# Altium project Cable_Test.PrjPcb
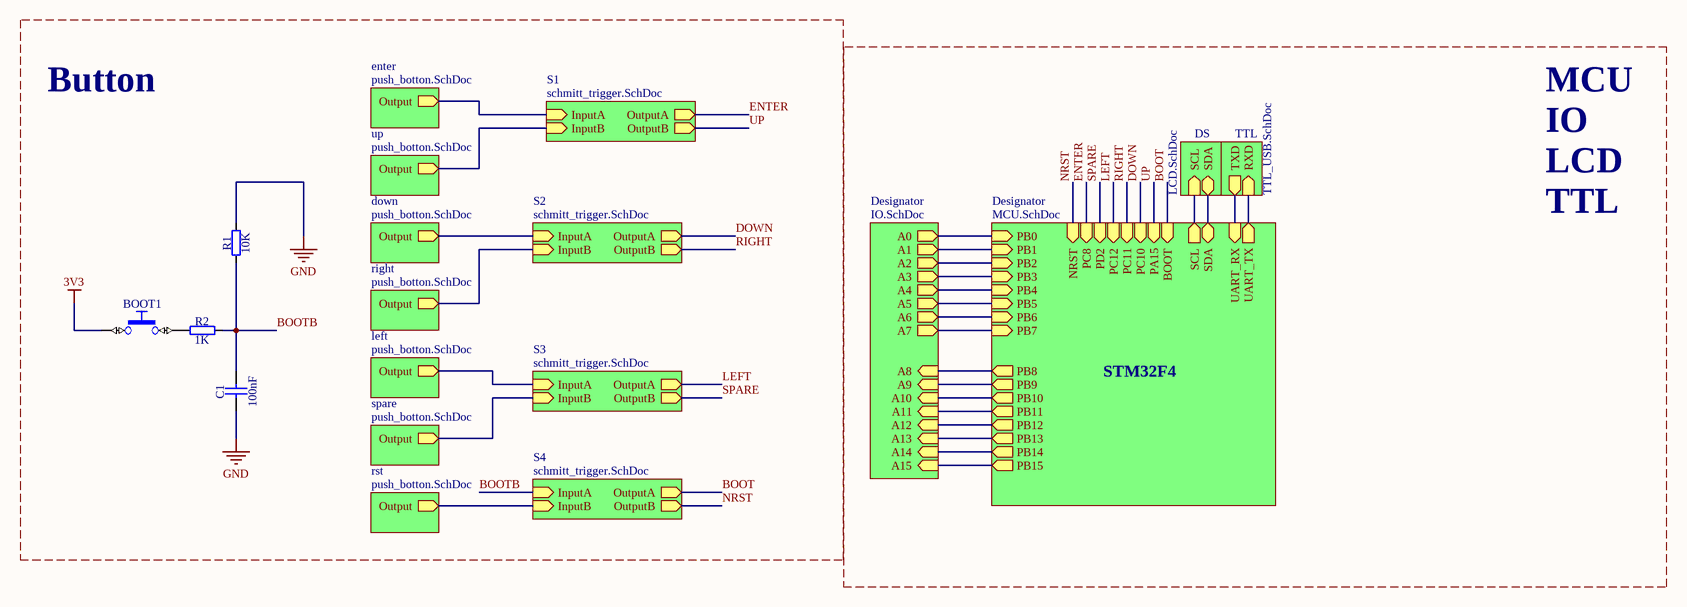
[diagram p0: CABLE_TEST.SchDoc]
8 sheets, 118 parts. Net scope: hierarchical (ports join the sheet entries above them; power ports are global).
Board file: cable_test.PcbDoc
Sheets:
  CABLE_TEST.SchDoc
    down = push_botton.SchDoc
    S1 = schmitt_trigger.SchDoc
    up = push_botton.SchDoc
    left = push_botton.SchDoc
    right = push_botton.SchDoc
    enter = push_botton.SchDoc
    spare = push_botton.SchDoc
    rst = push_botton.SchDoc
    S2 = schmitt_trigger.SchDoc
    S3 = schmitt_trigger.SchDoc
    S4 = schmitt_trigger.SchDoc
    DS = LCD.SchDoc
    TTL = TTL_USB.SchDoc
    Designator = MCU.SchDoc
    Designator = IO.SchDoc
  Power.SchDoc

## Sheet CABLE_TEST.SchDoc
size A3; SheetNumber: 1; SheetTotal: 8

### Parts
BOOT1  Push Button  [PB_TYCO_FSMSM]  (value not drawn)
C1  100nF  [CAPC2012X135N]
R1  10K  [RESC2012X60N]
R2  1K  [RESC2012X60N]

### Blocks framed on the sheet
Button: BOOT1 C1 R1 R2

### Sub-sheets
Designator = MCU.SchDoc: PB0 (in), PB1 (in), PB2 (in), PB3 (in), PB4 (in), PB5 (in), PB6 (in), PB7 (in), PB8 (out), PB10 (out), PB11 (out), PB12 (out), PB13 (out), PB14 (out), PB15 (out), PB9 (out), SCL (out), SDA (bidir), UART_RX (in), UART_TX (out), PD2 (in), PC12 (in), PC11 (in), PC10 (in), PA15 (in), PC8 (in), NRST (in), BOOT (in)
Designator = IO.SchDoc: A0 (out), A1 (out), A2 (out), A3 (out), A4 (out), A5 (out), A6 (out), A7 (out), A8 (in), A9 (in), A10 (in), A11 (in), A12 (in), A13 (in), A14 (in), A15 (in)
down = push_botton.SchDoc: Output (out)
DS = LCD.SchDoc: SCL (in), SDA (bidir)
enter = push_botton.SchDoc: Output (out)
left = push_botton.SchDoc: Output (out)
right = push_botton.SchDoc: Output (out)
rst = push_botton.SchDoc: Output (out)
S1 = schmitt_trigger.SchDoc: InputA (in), InputB (in), OutputA (out), OutputB (out)
S2 = schmitt_trigger.SchDoc: InputA (in), InputB (in), OutputA (out), OutputB (out)
S3 = schmitt_trigger.SchDoc: InputA (in), InputB (in), OutputA (out), OutputB (out)
S4 = schmitt_trigger.SchDoc: InputA (in), InputB (in), OutputA (out), OutputB (out)
spare = push_botton.SchDoc: Output (out)
TTL = TTL_USB.SchDoc: RXD (in), TXD (out)
up = push_botton.SchDoc: Output (out)

### Nets
3V3: BOOT1.1
GND: C1.1 R1.2
A0: sheet Designator/PB0, sheet Designator/A0
A1: sheet Designator/PB1, sheet Designator/A1
A2: sheet Designator/PB2, sheet Designator/A2
A3: sheet Designator/PB3, sheet Designator/A3
A4: sheet Designator/PB4, sheet Designator/A4
A5: sheet Designator/PB5, sheet Designator/A5
A6: sheet Designator/PB6, sheet Designator/A6
A7: sheet Designator/PB7, sheet Designator/A7
A8: sheet Designator/PB8, sheet Designator/A8
A9: sheet Designator/PB9, sheet Designator/A9
A10: sheet Designator/PB10, sheet Designator/A10
A11: sheet Designator/PB11, sheet Designator/A11
A12: sheet Designator/PB12, sheet Designator/A12
A13: sheet Designator/PB13, sheet Designator/A13
A14: sheet Designator/PB14, sheet Designator/A14
A15: sheet Designator/PB15, sheet Designator/A15
BOOT: sheet S4/OutputA, sheet Designator/BOOT
BOOTB: C1.2 R1.1 R2.2 ; sheet S4/InputA
DOWN: sheet S2/OutputA, sheet Designator/PC10
ENTER: sheet S1/OutputA, sheet Designator/PC8
LEFT: sheet S3/OutputA, sheet Designator/PC12
NRST: sheet S4/OutputB, sheet Designator/NRST
PA8: sheet DS/SCL, sheet Designator/SCL
PA9: sheet TTL/RXD, sheet Designator/UART_TX
PA10: sheet TTL/TXD, sheet Designator/UART_RX
PC9: sheet DS/SDA, sheet Designator/SDA
RIGHT: sheet S2/OutputB, sheet Designator/PC11
SPARE: sheet S3/OutputB, sheet Designator/PD2
UP: sheet S1/OutputB, sheet Designator/PA15
NetBOOT1_2: BOOT1.2 R2.1
NetC2_down_2: sheet down/Output, sheet S2/InputA
NetC2_enter_2: sheet S1/InputA, sheet enter/Output
NetC2_left_2: sheet left/Output, sheet S3/InputA
NetC2_right_2: sheet right/Output, sheet S2/InputB
NetC2_rst_2: sheet rst/Output, sheet S4/InputB
NetC2_spare_2: sheet spare/Output, sheet S3/InputB
NetC2_up_2: sheet S1/InputB, sheet up/Output

### Notes on the sheet
- MCU
- IO
- LCD
- TTL
- STM32F4

### Library data of the parts
BOOT1 = PB_TYCO_FSMSM: Push-Button Switch SPST; Part Description: 12VDC 50mA SPST Tactile Push-Button Switch; Manufacturer: TYCO ELECTRONICS; Manufacturer Part Number: FSMSM or 1437566-3; PressFit: No; Part Number: PB_TYCO_FSMSM; Component Kind: Standard; Component Type: Standard; Pin Count: 2; PackageDescription: Body 3.5x6.0mm, Pushbutton Switch, TYCO ALCOSWITCH FSMSM Serie; Family: Push Button; Mounted: Yes; Socket: No; SMD: Yes; Sense: No; Status: None; ComponentHeight: 4.3mm; HelpURL: \\cern.ch\dfs\Applications\Altium\Datasheets\PB_TYCO_FSMSM.pdf; Author: CERN DEM JLC; CreateDate: 6/30/2008; LatestRevisionDate: 6/21/2012
C1 = CC0805_100NF_50V_10%_X7R: Non-polarised capacitor; Part Description: SMD Multilayer Chip Ceramic Capacitor; Manufacturer: GENERIC; Manufacturer1 Part Number: C2012X7R1H104K085; Voltage: 50V; TC: X7R; Tolerance: ±10%; Part Number: CC0805_100NF_50V_10%_X7R; Component Kind: Standard; Component Type: Standard; Pin Count: 2; Value: 100nF; Status: None; Manufacturer Part Number: CC0805_100NF_50V_10%_X7R; Case: 0805; Mounted: Yes; Socket: No; SMD: Yes; Sense: No; Manufacturer1 Example: TDK; Manufacturer1 ComponentHeight: 1mm; HelpURL: \\cern.ch\dfs\Applications\Altium\Datasheets\CC0805_X7R_TDK_C.pdf; Author: CERN DEM JLC; CreateDate: 12/3/2007; LatestRevisionDate: 4/22/2015
R1 R2 = R0805_24K_1%_0.125W_100PPM: Resistor - 1%; Part Description: General Purpose Thick Film Chip Resistor; Manufacturer: GENERIC; Manufacturer1 Part Number: NRC10F2402TRF; Power: 0.125W; TC: ±100ppm/°C; PressFit: No; Part Number: R0805_24K_1%_0.125W_100PPM; Component Kind: Standard; Component Type: Standard; Pin Count: 2; Status: Preferred; Tolerance: ±1%; Manufacturer Part Number: R0805_24K_1%_0.125W_100PPM; Case: 0805; Mounted: Yes; Sense: No; Socket: No; SMD: Yes; HelpURL: \\cern.ch\dfs\Applications\Altium\Datasheets\R0805_NIC_NRC.pdf; Author: CERN DEM JLC; CreateDate: 12/3/2007; LatestRevisionDate: 3/13/2008; Manufacturer1 Example: NIC COMPONENT; Manufacturer1 ComponentHeight: 0.6mm
  R1: Value: 10K
  R2: Value: 1K

## Sheet push_botton.SchDoc
size A; SheetNumber: 2; SheetTotal: 8
Used 7 times, as channels down, up, left, right, enter, spare, rst. Parts and nets are listed once, with the designators drawn on the sheet.
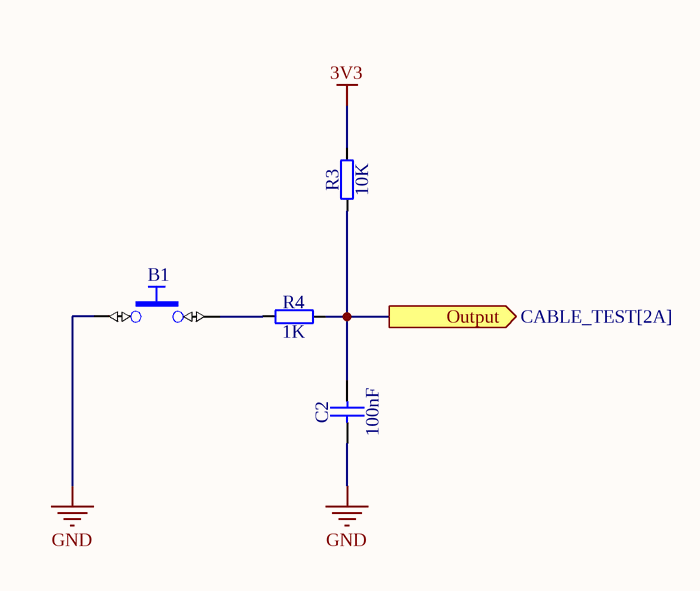
[diagram p1: push_botton.SchDoc]

### Parts
B1  Push Button  [PB_TYCO_FSMSM]  (value not drawn)
C2  100nF  [CAPC2012X135N]
R3  10K  [RESC2012X60N]
R4  1K  [RESC2012X60N]

### Ports
Output (out, see CABLE_TEST[2A])

### Nets
3V3: R3.2
GND: B1.1 C2.1
Output: C2.2 R3.1 R4.2 ; port Output
NetB1_2: B1.2 R4.1

### Channels
down: designators end in _down; ports Output=NetC2_down_2
up: designators end in _up; ports Output=NetC2_up_2
left: designators end in _left; ports Output=NetC2_left_2
right: designators end in _right; ports Output=NetC2_right_2
enter: designators end in _enter; ports Output=NetC2_enter_2
spare: designators end in _spare; ports Output=NetC2_spare_2
rst: designators end in _rst; ports Output=NetC2_rst_2

### Library data of the parts
B1 = PB_TYCO_FSMSM: as BOOT1 on sheet CABLE_TEST; Part Number: PB_TYCO_FSMSM; Component Kind: Standard; Component Type: Standard; Pin Count: 2; PackageDescription: Body 3.5x6.0mm, Pushbutton Switch, TYCO ALCOSWITCH FSMSM Serie; Family: Push Button; Mounted: Yes; Socket: No; SMD: Yes; Sense: No; Status: None; ComponentHeight: 4.3mm; HelpURL: \\cern.ch\dfs\Applications\Altium\Datasheets\PB_TYCO_FSMSM.pdf; Author: CERN DEM JLC; CreateDate: 6/30/2008; LatestRevisionDate: 6/21/2012
C2 = CC0805_100NF_50V_10%_X7R: as C1 on sheet CABLE_TEST; Part Number: CC0805_100NF_50V_10%_X7R; Component Kind: Standard; Component Type: Standard; Pin Count: 2; Value: 100nF; Status: None; Manufacturer Part Number: CC0805_100NF_50V_10%_X7R; Case: 0805; Mounted: Yes; Socket: No; SMD: Yes; Sense: No; Manufacturer1 Example: TDK; Manufacturer1 ComponentHeight: 1mm; HelpURL: \\cern.ch\dfs\Applications\Altium\Datasheets\CC0805_X7R_TDK_C.pdf; Author: CERN DEM JLC; CreateDate: 12/3/2007; LatestRevisionDate: 4/22/2015
R3 R4 = R0805_24K_1%_0.125W_100PPM: as R1 on sheet CABLE_TEST; Part Number: R0805_24K_1%_0.125W_100PPM; Component Kind: Standard; Component Type: Standard; Pin Count: 2; Status: Preferred; Tolerance: ±1%; Manufacturer Part Number: R0805_24K_1%_0.125W_100PPM; Case: 0805; Mounted: Yes; Sense: No; Socket: No; SMD: Yes; HelpURL: \\cern.ch\dfs\Applications\Altium\Datasheets\R0805_NIC_NRC.pdf; Author: CERN DEM JLC; CreateDate: 12/3/2007; LatestRevisionDate: 3/13/2008; Manufacturer1 Example: NIC COMPONENT; Manufacturer1 ComponentHeight: 0.6mm
  R3: Value: 10K
  R4: Value: 1K

## Sheet schmitt_trigger.SchDoc
size A; SheetNumber: 3; SheetTotal: 8
Used 4 times, as channels S1, S2, S3, S4. Parts and nets are listed once, with the designators drawn on the sheet.
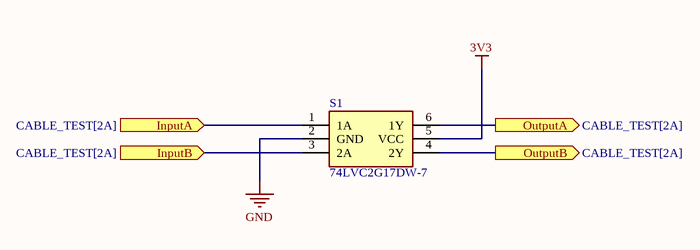
[diagram p2: schmitt_trigger.SchDoc]

### Parts
S1  74LVC2G17DW-7  [SOT65P210X110-6N]

### Ports
InputA (in, see CABLE_TEST[2A]), InputB (in, see CABLE_TEST[2A]), OutputA (out, see CABLE_TEST[2A]), OutputB (out, see CABLE_TEST[2A])

### Nets
3V3: S1.5(VCC)
GND: S1.2(GND)
InputA: S1.1(1A) ; port InputA
InputB: S1.3(2A) ; port InputB
OutputA: S1.6(1Y) ; port OutputA
OutputB: S1.4(2Y) ; port OutputB

### Channels
S1: designators end in _S1; ports InputA=NetC2_enter_2 InputB=NetC2_up_2 OutputA=ENTER OutputB=UP
S2: designators end in _S2; ports InputA=NetC2_down_2 InputB=NetC2_right_2 OutputA=DOWN OutputB=RIGHT
S3: designators end in _S3; ports InputA=NetC2_left_2 InputB=NetC2_spare_2 OutputA=LEFT OutputB=SPARE
S4: designators end in _S4; ports InputA=BOOTB InputB=NetC2_rst_2 OutputA=BOOT OutputB=NRST

### Library data of the parts
S1 = 74LVC2G17DW-7: Integrated Circuit; Manufacturer_Name: Diodes Incorporated; Datasheet Link: https://www.diodes.com//assets/Datasheets/74LVC2G17.pdf; Height: 1.1mm; Manufacturer_Part_Number: 74LVC2G17DW-7; Mouser Part Number: 621-74LVC2G17DW-7; Mouser Price/Stock: https://www.mouser.co.uk/ProductDetail/Diodes-Incorporated/74LVC2G17DW-7?qs=MKoP7Oyr0W5RvcSrLnJhQA%3D%3D; Arrow Part Number: 74LVC2G17DW-7; Arrow Price/Stock: https://www.arrow.com/en/products/74lvc2g17dw-7/diodes-incorporated?utm_currency=USD&region=nac

## Sheet LCD.SchDoc
size A; SheetNumber: 4; SheetTotal: 8
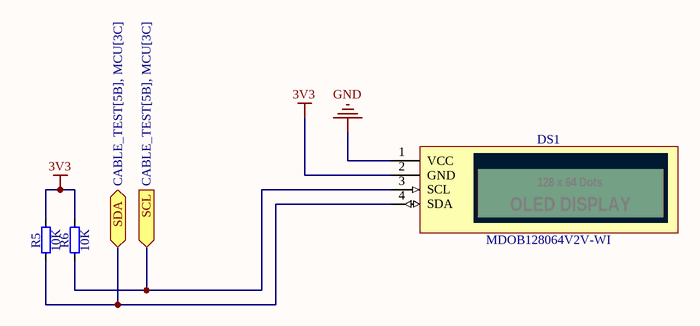
[diagram p3: LCD.SchDoc]

### Parts
DS1  MDOB128064V2V-WI  [DS_MIDAS_MDOB128064V2V-WI]
R5  10K  [RESC2012X60N]
R6  10K  [RESC2012X60N]

### Ports
SCL (in, see CABLE_TEST[5B], MCU[3C]), SDA (bidir, see CABLE_TEST[5B], MCU[3C])

### Nets
3V3: DS1.2(GND) R5.2 R6.2
GND: DS1.1(VCC)
PA8: DS1.3(SCL) R6.1 ; port SCL
PC9: DS1.4(SDA) R5.1 ; port SDA

### Notes on the sheet
- (in symbol DS_MIDAS_MDOB128064V2V-WI) 128 x 64 Dots; OLED DISPLAY

### Library data of the parts
DS1 = DS_MIDAS_MDOB128064V2V-WI: LCD Display, Display Color White, I2C Bus Data Interface, 128 x 64 Dots Matrix; Manufacturer: MIDAS DISPLAY; PressFit: No; Sense Comment: Manual Soldering and Non-washable; Bonding: No; Status Comment: Sensitive (See Sensitive Field); Part Number: DS_MIDAS_MDOB128064V2V-WI; Component Kind: Standard; Component Type: Standard; Device: MDOB128064V2V-WI; PackageDescription: LCD Display Module, 128 x 64 Dots Matrix, Body 27.3x27.3mm; Part Description: LCD Display, Display Color White, I2C Bus Data Interface, 128 x 64 Dots Matrix; Manufacturer Part Number: MDOB128064V2V-WI; Pin Count: 4; Mounted: Yes; Socket: No; SMD: No; Sense: Yes; ComponentHeight: 3.87mm; HelpURL: \\cern.ch\dfs\Applications\Altium\Datasheets\DS_MIDAS_MDOB128064V2V-WI.pdf; Author: CERN DEM BC; CreateDate: 1/27/2020; LatestRevisionDate: 1/27/2020
R5 R6 = R0805_24K_1%_0.125W_100PPM: as R1 on sheet CABLE_TEST; Part Number: R0805_24K_1%_0.125W_100PPM; Component Kind: Standard; Component Type: Standard; Pin Count: 2; Value: 10K; Status: Preferred; Tolerance: ±1%; Manufacturer Part Number: R0805_24K_1%_0.125W_100PPM; Case: 0805; Mounted: Yes; Sense: No; Socket: No; SMD: Yes; HelpURL: \\cern.ch\dfs\Applications\Altium\Datasheets\R0805_NIC_NRC.pdf; Author: CERN DEM JLC; CreateDate: 12/3/2007; LatestRevisionDate: 3/13/2008; Manufacturer1 Example: NIC COMPONENT; Manufacturer1 ComponentHeight: 0.6mm

## Sheet TTL_USB.SchDoc
size A; SheetNumber: 5; SheetTotal: 8
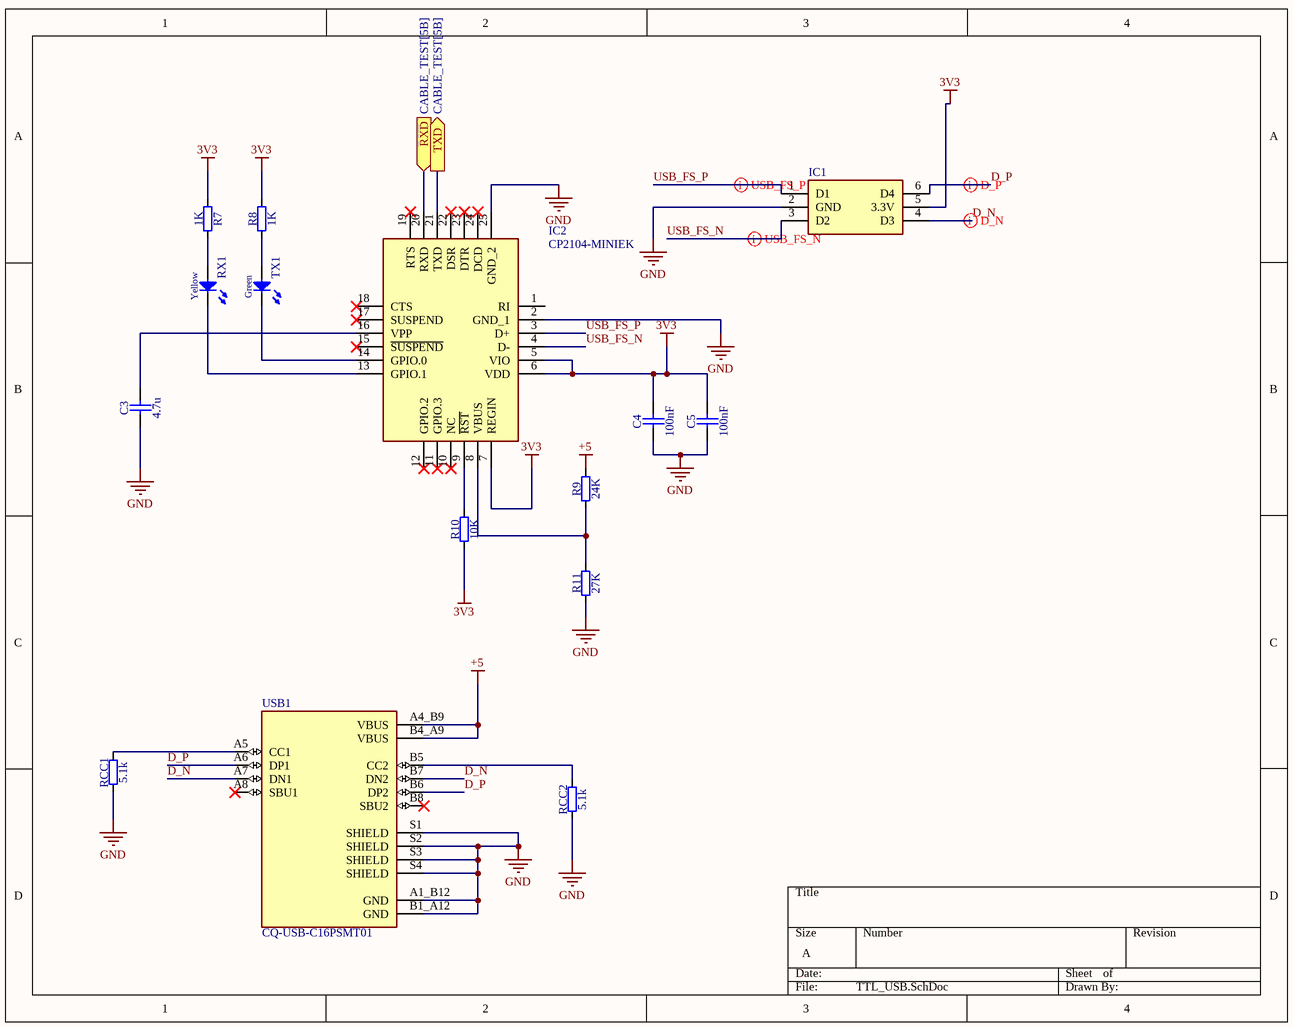
[diagram p4: TTL_USB.SchDoc]

### Parts
C3  4.7u  [CAPC2012X135N]
C4  100nF  [CAPC2012X135N]
C5  100nF  [CAPC2012X135N]
IC1  (no value)  [SOT65P210X110-6N]
IC2  CP2104-MINIEK  [QFN50P400X400X80-25N-D]
R7  1K  [RESC2012X60N]
R8  1K  [RESC2012X60N]
R9  24K  [RESC2012X60N]
R10  10K  [RESC2012X60N]
R11  27K  [RESC2012X60N]
RCC1  5.1k  [RESC2012X60N]
RCC2  5.1k  [RESC2012X60N]
RX1  Yellow  [LED_3MM_YELLOW_1C-2A]
TX1  Green  [LED_3MM_GREEN_1C-2A]
USB1  CQ-USB-C16PSMT01  [SHENZHEN-CHUANGQIN-TECHNOLOGY_CQ-USB-C16PSMT01]

### Ports
RXD (in, see CABLE_TEST[5B]), TXD (out, see CABLE_TEST[5B])

### Nets
3V3: C4.2 C5.2 IC1.5(3.3V) IC2.5(VIO) IC2.6(VDD) IC2.7(REGIN) R7.1 R8.2 R10.1
+5: R9.2 USB1.A4_B9(VBUS) USB1.B4_A9(VBUS)
GND: C3.1 C4.1 C5.1 IC1.2(GND) IC2.2(GND_1) IC2.25(GND_2) R11.1 RCC1.1 RCC2.1 USB1.A1_B12(GND) USB1.B1_A12(GND) USB1.S1(SHIELD) USB1.S2(SHIELD) USB1.S3(SHIELD) USB1.S4(SHIELD)
D_N: IC1.4(D3) USB1.A7(DN1) USB1.B7(DN2)
D_P: IC1.6(D4) USB1.A6(DP1) USB1.B6(DP2)
PA9: IC2.20(RXD) ; port RXD
PA10: IC2.21(TXD) ; port TXD
USB_FS_N: IC1.3(D2) IC2.4(D-)
USB_FS_P: IC1.1(D1) IC2.3(D+)
NetC3_2: C3.2 IC2.16(VPP)
NetIC2_8: IC2.8(VBUS) R9.1 R11.2
NetIC2_9: IC2.9(~{RST}) R10.2
NetIC2_13: IC2.13(GPIO.1) RX1.1(C)
NetIC2_14: IC2.14(GPIO.0) TX1.1(C)
NetR7_2: R7.2 RX1.2(A)
NetR8_1: R8.1 TX1.2(A)
NetRCC1_2: RCC1.2 USB1.A5(CC1)
NetRCC2_2: RCC2.2 USB1.B5(CC2)

Not connected (* = marked no-connect by the designer): IC2 1(RI) 10(NC)* 11(GPIO.3)* 12(GPIO.2)* 15(~{SUSPEND})* 17(SUSPEND)* 18(CTS)* 19(RTS)* 22(DSR)* 23(DTR)* 24(DCD)*; USB1 A8(SBU1)* B8(SBU2)*

### Layout directives
differential pair: D_N, D_P, USB_FS_N, USB_FS_P

### Library data of the parts
C3-C5 = CC0805_100NF_50V_10%_X7R: as C1 on sheet CABLE_TEST; Part Number: CC0805_100NF_50V_10%_X7R; Component Kind: Standard; Component Type: Standard; Pin Count: 2; Status: None; Manufacturer Part Number: CC0805_100NF_50V_10%_X7R; Case: 0805; Mounted: Yes; Socket: No; SMD: Yes; Sense: No; Manufacturer1 Example: TDK; Manufacturer1 ComponentHeight: 1mm; HelpURL: \\cern.ch\dfs\Applications\Altium\Datasheets\CC0805_X7R_TDK_C.pdf; Author: CERN DEM JLC; CreateDate: 12/3/2007; LatestRevisionDate: 4/22/2015
  C3: Value: 4.7u
  C4 C5: Value: 100nF
IC1 = USBUF02W6: Integrated Circuit; IPN: 1245; Voltage: 8KV; Category: Diode; Mounting Type: SMD
IC2 = CP2104-MINIEK: Integrated Circuit; Manufacturer_Name: Silicon Labs; Datasheet Link: https://www.silabs.com/documents/public/data-sheets/cp2104.pdf; Height: 0.8mm; Manufacturer_Part_Number: CP2104-MINIEK; Mouser Part Number: 634-CP2104-MINIEK; Mouser Price/Stock: https://www.mouser.co.uk/ProductDetail/Silicon-Labs/CP2104-MINIEK?qs=FYfXKmhrYXPeBq%2FwIaWTFg%3D%3D; Arrow Part Number: CP2104-MINIEK; Arrow Price/Stock: https://www.arrow.com/en/products/cp2104-miniek/silicon-labs?utm_currency=USD&region=nac
R7-R11 RCC1 RCC2 = R0805_24K_1%_0.125W_100PPM: as R1 on sheet CABLE_TEST; Part Number: R0805_24K_1%_0.125W_100PPM; Component Kind: Standard; Component Type: Standard; Pin Count: 2; Status: Preferred; Tolerance: ±1%; Manufacturer Part Number: R0805_24K_1%_0.125W_100PPM; Case: 0805; Mounted: Yes; Sense: No; Socket: No; SMD: Yes; HelpURL: \\cern.ch\dfs\Applications\Altium\Datasheets\R0805_NIC_NRC.pdf; Author: CERN DEM JLC; CreateDate: 12/3/2007; LatestRevisionDate: 3/13/2008; Manufacturer1 Example: NIC COMPONENT; Manufacturer1 ComponentHeight: 0.6mm
  R7 R8: Value: 1K
  R9: Value: 24K
  R10: Value: 10K
  R11: Value: 27K
  RCC1 RCC2: Value: 5.1k
RX1 = LED_AVAGO_HLMP-1719: LED Yellow 1C 2A; Part Description: 3mm Yellow LED; Manufacturer: AVAGO TECHNOLOGIES; PressFit: No; Bonding: No; Part Number: LED_AVAGO_HLMP-1719; Component Kind: Standard; Component Type: Standard; Color: Yellow; PackageDescription: LED, Yellow, Body Dia. 3.43 mm, Pin spacing 2.54mm; Manufacturer Part Number: HLMP-1719; Pin Count: 2; Mounted: Yes; Socket: No; SMD: No; Sense: No; ComponentHeight: 6.35mm(min); HelpURL: \\cern.ch\dfs\Applications\Altium\Datasheets\LED_AVAGO_HLMP-1719.pdf; Author: CERN DEM JLC; CreateDate: 6/12/2008; LatestRevisionDate: 3/17/2010
TX1 = LED_AVAGO_HLMP-1790: LED Green 1C 2A; Part Description: 3mm Green LED; Manufacturer: AVAGO TECHNOLOGIES; PressFit: No; Bonding: No; Part Number: LED_AVAGO_HLMP-1790; Component Kind: Standard; Component Type: Standard; Color: Green; PackageDescription: LED, Green, Body Dia. 3.43 mm, Pin spacing 2.54mm; Manufacturer Part Number: HLMP-1790; Pin Count: 2; Mounted: Yes; Socket: No; SMD: No; Sense: No; ComponentHeight: 6.35mm(min); HelpURL: \\cern.ch\dfs\Applications\Altium\Datasheets\LED_AVAGO_HLMP-1790.pdf; Author: CERN DEM JLC; CreateDate: 6/12/2008; LatestRevisionDate: 3/17/2010
USB1 = CQ-USB-C16PSMT01: C Type USB Type-C Female Plug 16 Pin Connector Power Charger Jack Port; MF: Shenzen Chuangqin Technology; SnapEDA_Link: https://www.snapeda.com/parts/CQ-USB-C16PSMT01/Shenzen+Chuangqin+Technology/view-part/?ref=snap; Package: Package; Value: *; MP: CQ-USB-C16PSMT01; Check_prices: https://www.snapeda.com/parts/CQ-USB-C16PSMT01/Shenzen+Chuangqin+Technology/view-part/?ref=eda

## Sheet MCU.SchDoc
size A3; SheetNumber: 6; SheetTotal: 8
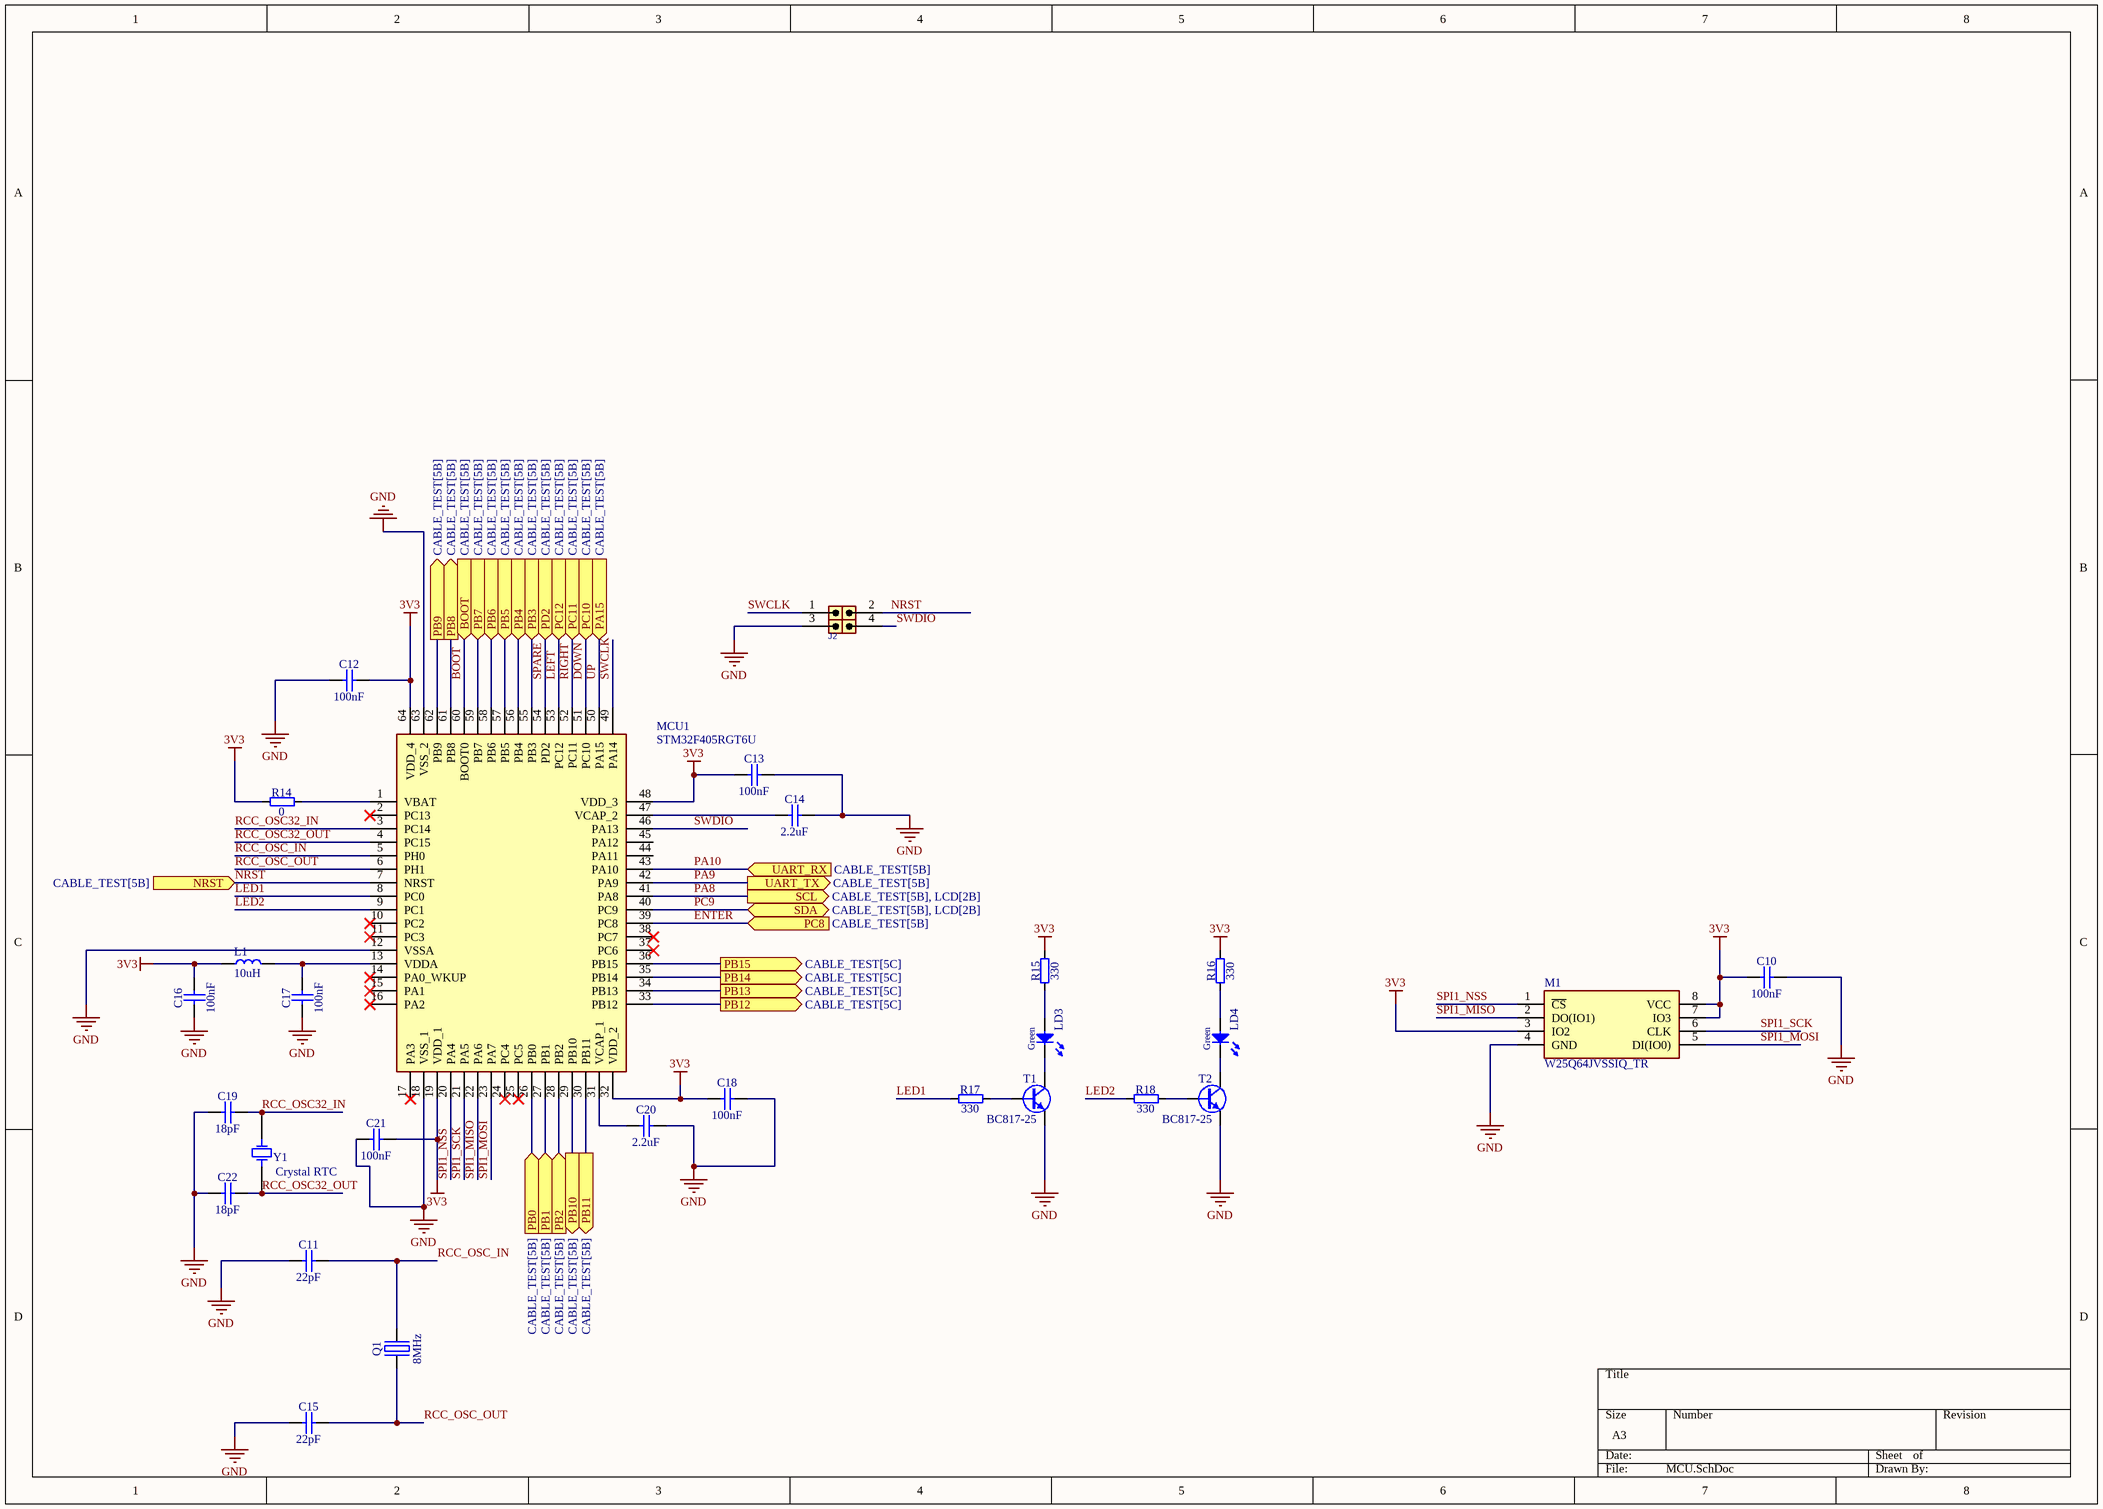
[diagram p5: MCU.SchDoc]

### Parts
C10  100nF  [CAPC2012X135N]
C11  22pF  [CAPC2012X135N]
C12  100nF  [CAPC2012X135N]
C13  100nF  [CAPC2012X135N]
C14  2.2uF  [CAPC2012X135N]
C15  22pF  [CAPC2012X135N]
C16  100nF  [CAPC2012X135N]
C17  100nF  [CAPC2012X135N]
C18  100nF  [CAPC2012X135N]
C19  18pF  [CAPC2012X135N]
C20  2.2uF  [CAPC2012X135N]
C21  100nF  [CAPC2012X135N]
C22  18pF  [CAPC2012X135N]
J2  Female Header dual 2  [HDR_F_2X2]  (value not drawn)
L1  value 10uH  [L0805]  (hidden comment: Inductor SMD NC 0805)
LD3  Green  [LED_3MM_GREEN_1C-2A]
LD4  Green  [LED_3MM_GREEN_1C-2A]
M1  W25Q64JVSSIQ_TR  [SOIC127P790X216-8N]
MCU1  STM32F405RGT6U  [QFP50P1200X1200X160-64N]
Q1  8MHz  [XTAL_CTS_ATS]
R14  0  [RESC2012X60N]
R15  330  [RESC2012X60N]
R16  330  [RESC2012X60N]
R17  330  [RESC2012X60N]
R18  330  [RESC2012X60N]
T1  BC817-25  [SOT95P230X110-3N]
T2  BC817-25  [SOT95P230X110-3N]
Y1  Crystal RTC  [Crystal Clock]

### Ports
BOOT (in, see CABLE_TEST[5B]), NRST (in, see CABLE_TEST[5B]), PA15 (in, see CABLE_TEST[5B]), PB0 (in, see CABLE_TEST[5B]), PB1 (in, see CABLE_TEST[5B]), PB2 (in, see CABLE_TEST[5B]), PB3 (in, see CABLE_TEST[5B]), PB4 (in, see CABLE_TEST[5B]), PB5 (in, see CABLE_TEST[5B]), PB6 (in, see CABLE_TEST[5B]), PB7 (in, see CABLE_TEST[5B]), PB8 (out, see CABLE_TEST[5B]), PB9 (out, see CABLE_TEST[5B]), PB10 (out, see CABLE_TEST[5B]), PB11 (out, see CABLE_TEST[5B]), PB12 (out, see CABLE_TEST[5C]), PB13 (out, see CABLE_TEST[5C]), PB14 (out, see CABLE_TEST[5C]), PB15 (out, see CABLE_TEST[5C]), PC8 (in, see CABLE_TEST[5B]), PC10 (in, see CABLE_TEST[5B]), PC11 (in, see CABLE_TEST[5B]), PC12 (in, see CABLE_TEST[5B]), PD2 (in, see CABLE_TEST[5B]), SCL (out, see CABLE_TEST[5B], LCD[2B]), SDA (bidir, see CABLE_TEST[5B], LCD[2B]), UART_RX (in, see CABLE_TEST[5B]), UART_TX (out, see CABLE_TEST[5B])

### Nets
3V3: C10.1 C12.2 C13.1 C16.2 C18.1 C21.2 L1.1 M1.3(IO2) M1.7(IO3) M1.8(VCC) MCU1.19(VDD_1) MCU1.32(VDD_2) MCU1.48(VDD_3) MCU1.64(VDD_4) R14.1 R15.2 R16.2
GND: C10.2 C11.1 C12.1 C13.2 C14.2 C15.1 C16.1 C17.1 C18.2 C19.1 C20.2 C21.1 C22.1 J2.3 M1.4(GND) MCU1.12(VSSA) MCU1.18(VSS_1) MCU1.63(VSS_2) T1.2(E) T2.2(E)
A0: MCU1.26(PB0) ; port PB0
A1: MCU1.27(PB1) ; port PB1
A2: MCU1.28(PB2) ; port PB2
A3: MCU1.55(PB3) ; port PB3
A4: MCU1.56(PB4) ; port PB4
A5: MCU1.57(PB5) ; port PB5
A6: MCU1.58(PB6) ; port PB6
A7: MCU1.59(PB7) ; port PB7
A8: MCU1.61(PB8) ; port PB8
A9: MCU1.62(PB9) ; port PB9
A10: MCU1.29(PB10) ; port PB10
A11: MCU1.30(PB11) ; port PB11
A12: MCU1.33(PB12) ; port PB12
A13: MCU1.34(PB13) ; port PB13
A14: MCU1.35(PB14) ; port PB14
A15: MCU1.36(PB15) ; port PB15
BOOT: MCU1.60(BOOT0) ; port BOOT
DOWN: MCU1.51(PC10) ; port PC10
ENTER: MCU1.39(PC8) ; port PC8
LED1: MCU1.8(PC0) R17.1
LED2: MCU1.9(PC1) R18.1
LEFT: MCU1.53(PC12) ; port PC12
NRST: J2.2 MCU1.7(NRST) ; port NRST
PA8: MCU1.41(PA8) ; port SCL
PA9: MCU1.42(PA9) ; port UART_TX
PA10: MCU1.43(PA10) ; port UART_RX
PC9: MCU1.40(PC9) ; port SDA
RCC_OSC32_IN: C19.2 MCU1.3(PC14) Y1.1
RCC_OSC32_OUT: C22.2 MCU1.4(PC15) Y1.2
RCC_OSC_IN: C11.2 MCU1.5(PH0) Q1.2(OSC2)
RCC_OSC_OUT: C15.2 MCU1.6(PH1) Q1.1(OSC1)
RIGHT: MCU1.52(PC11) ; port PC11
SPARE: MCU1.54(PD2) ; port PD2
SPI1_MISO: M1.2(DO(IO1)) MCU1.22(PA6)
SPI1_MOSI: M1.5(DI(IO0)) MCU1.23(PA7)
SPI1_NSS: M1.1(~{CS}) MCU1.20(PA4)
SPI1_SCK: M1.6(CLK) MCU1.21(PA5)
SWCLK: J2.1 MCU1.49(PA14)
SWDIO: J2.4 MCU1.46(PA13)
UP: MCU1.50(PA15) ; port PA15
NetC14_1: C14.1 MCU1.47(VCAP_2)
NetC17_2: C17.2 L1.2 MCU1.13(VDDA)
NetC20_1: C20.1 MCU1.31(VCAP_1)
NetLD3_1: LD3.1(C) T1.3(C)
NetLD3_2: LD3.2(A) R15.1
NetLD4_1: LD4.1(C) T2.3(C)
NetLD4_2: LD4.2(A) R16.1
NetMCU1_1: MCU1.1(VBAT) R14.2
NetR17_2: R17.2 T1.1(B)
NetR18_2: R18.2 T2.1(B)

Not connected (* = marked no-connect by the designer): MCU1 2(PC13)* 10(PC2)* 11(PC3)* 14(PA0_WKUP)* 15(PA1)* 16(PA2)* 17(PA3)* 24(PC4)* 25(PC5)* 37(PC6)* 38(PC7)* 44(PA11) 45(PA12)

### Library data of the parts
C10 = CC0805_1.2PF_50V_0.25PF_NP0: Non-polarised capacitor; Part Description: SMD Multilayer Chip Ceramic Capacitor; Manufacturer: GENERIC; Manufacturer1 Part Number: 223886114128; Voltage: 50V; TC: C0G/NP0; Tolerance: ±0.25pF; Part Number: CC0805_1.2PF_50V_0.25PF_NP0; Component Kind: Standard; Component Type: Standard; Pin Count: 2; Value: 100nF; Status: Not Recommended; Manufacturer Part Number: CC0805_1.2PF_50V_0.25PF_NP0; Case: 0805; Mounted: Yes; Socket: No; SMD: Yes; Sense: No; Manufacturer1 Example: PHYCOMP; Manufacturer1 ComponentHeight: 1.35mm; HelpURL: \\cern.ch\dfs\Applications\Altium\Datasheets\CC0805_NP0_PHYCOMP.pdf; Author: CERN DEM JLC; CreateDate: 12/3/2007; LatestRevisionDate: 12/3/2007
C11-C22 = CC0805_100NF_50V_10%_X7R: as C1 on sheet CABLE_TEST; Part Number: CC0805_100NF_50V_10%_X7R; Component Kind: Standard; Component Type: Standard; Pin Count: 2; Status: None; Manufacturer Part Number: CC0805_100NF_50V_10%_X7R; Case: 0805; Mounted: Yes; Socket: No; SMD: Yes; Sense: No; Manufacturer1 Example: TDK; Manufacturer1 ComponentHeight: 1mm; HelpURL: \\cern.ch\dfs\Applications\Altium\Datasheets\CC0805_X7R_TDK_C.pdf; Author: CERN DEM JLC; CreateDate: 12/3/2007; LatestRevisionDate: 4/22/2015
  C11 C15: Value: 22pF
  C12 C13 C16-C18 C21: Value: 100nF
  C14 C20: Value: 2.2uF
  C19 C22: Value: 18pF
J2 = Female Header dual 2: Female, pitch: 2.54mm; Category: Connector
L1 = Inductor SMD NC 0805: Current: 200mA; IPN: 1030; Category: inductor; Package: 0805; Mounting Type: SMD
LD3 LD4 = LED_AVAGO_HLMP-1790: as TX1 on sheet TTL_USB; Part Number: LED_AVAGO_HLMP-1790; Component Kind: Standard; Component Type: Standard; Color: Green; PackageDescription: LED, Green, Body Dia. 3.43 mm, Pin spacing 2.54mm; Manufacturer Part Number: HLMP-1790; Pin Count: 2; Mounted: Yes; Socket: No; SMD: No; Sense: No; ComponentHeight: 6.35mm(min); HelpURL: \\cern.ch\dfs\Applications\Altium\Datasheets\LED_AVAGO_HLMP-1790.pdf; Author: CERN DEM JLC; CreateDate: 6/12/2008; LatestRevisionDate: 3/17/2010
M1 = W25Q64JVSSIQ_TR: Integrated Circuit; Manufacturer_Name: Winbond; Manufacturer_Part_Number: W25Q64JVSSIQ TR; Datasheet Link: http://www.winbond.com/resource-files/w25q64jv%20spi%20revg%2012142016.pdf; Height: 2.16mm; Mouser Part Number: 454-W25Q64JVSSIQTR; Mouser Price/Stock: https://www.mouser.co.uk/ProductDetail/Winbond/W25Q64JVSSIQ-TR?qs=qSfuJ%252Bfl%2Fd6FZTXsjBFnrA%3D%3D; Arrow Part Number: W25Q64JVSSIQ TR; Arrow Price/Stock: https://www.arrow.com/en/products/w25q64jvssiqtr/winbond-electronics?utm_currency=USD&region=nac
MCU1 = STM32F405RGT6U: Integrated Circuit; Manufacturer_Name: STMicroelectronics; Height: 1.6mm; Manufacturer_Part_Number: STM32F405RGT6U; Mouser Part Number: 511-STM32F405RGT6U; Mouser Price/Stock: https://www.mouser.co.uk/ProductDetail/STMicroelectronics/STM32F405RGT6U?qs=4ccVDqXDOrkfyBTYAli8sw%3D%3D
Q1 = XTAL_10MHZ_CTS_ATS100B-E: Quartz Crystal; Part Description: Tolerance: ±30ppm, Stability: ±50ppm, -40°C to +85°C, 18pF, 40 Ohms ESR, Quartz Crystal, ATS Series; Manufacturer: CTS; PressFit: No; Bonding: No; Part Number: XTAL_10MHZ_CTS_ATS100B-E; Component Kind: Standard; Component Type: Standard; PackageDescription: THD Crystal,HC-49/US Case Body 10.85x4.5mm; Pitch 4.88mm; Value: 8MHz; Manufacturer Part Number: ATS100B-E; Pin Count: 2; Mounted: Yes; Socket: No; SMD: No; Sense: No; ComponentHeight: 3.3mm; HelpURL: \\cern.ch\dfs\Applications\Altium\Datasheets\XTAL_CTS_ATS.pdf; Author: CERN DEM HF; CreateDate: 10/25/2022; LatestRevisionDate: 10/25/2022
R14-R18 = R0805_24K_1%_0.125W_100PPM: as R1 on sheet CABLE_TEST; Part Number: R0805_24K_1%_0.125W_100PPM; Component Kind: Standard; Component Type: Standard; Pin Count: 2; Status: Preferred; Tolerance: ±1%; Manufacturer Part Number: R0805_24K_1%_0.125W_100PPM; Case: 0805; Mounted: Yes; Sense: No; Socket: No; SMD: Yes; HelpURL: \\cern.ch\dfs\Applications\Altium\Datasheets\R0805_NIC_NRC.pdf; Author: CERN DEM JLC; CreateDate: 12/3/2007; LatestRevisionDate: 3/13/2008; Manufacturer1 Example: NIC COMPONENT; Manufacturer1 ComponentHeight: 0.6mm
  R14: Value: 0
  R15-R18: Value: 330
T1 T2 = BC817-25: NPN Transistor; Part Description: 45V 500mA NPN General-Purpose Transistor; Manufacturer: NXP SEMICONDUCTORS; PressFit: No; Bonding: No; Part Number: BC817-25; Component Kind: Standard; Component Type: Standard; Device: BC817-25; PackageDescription: SOT23, 0.95mm Pitch; 3 Pin, 1.30mm W X 2.90mm L X 1.10mm H body, IPC Medium Density; Manufacturer Part Number: BC817-25; Pin Count: 3; Case: SOT23-3; Mounted: Yes; Socket: No; SMD: Yes; Sense: No; ComponentHeight: 1.1mm; HelpURL: \\cern.ch\dfs\Applications\Altium\Datasheets\BC817-25.pdf; Author: CERN DEM JLC; CreateDate: 10/28/2014; LatestRevisionDate: 10/28/2014
Y1 = Crystal RTC: Crystal; Category: Crystal

## Sheet IO.SchDoc
size A3; SheetNumber: 7; SheetTotal: 8
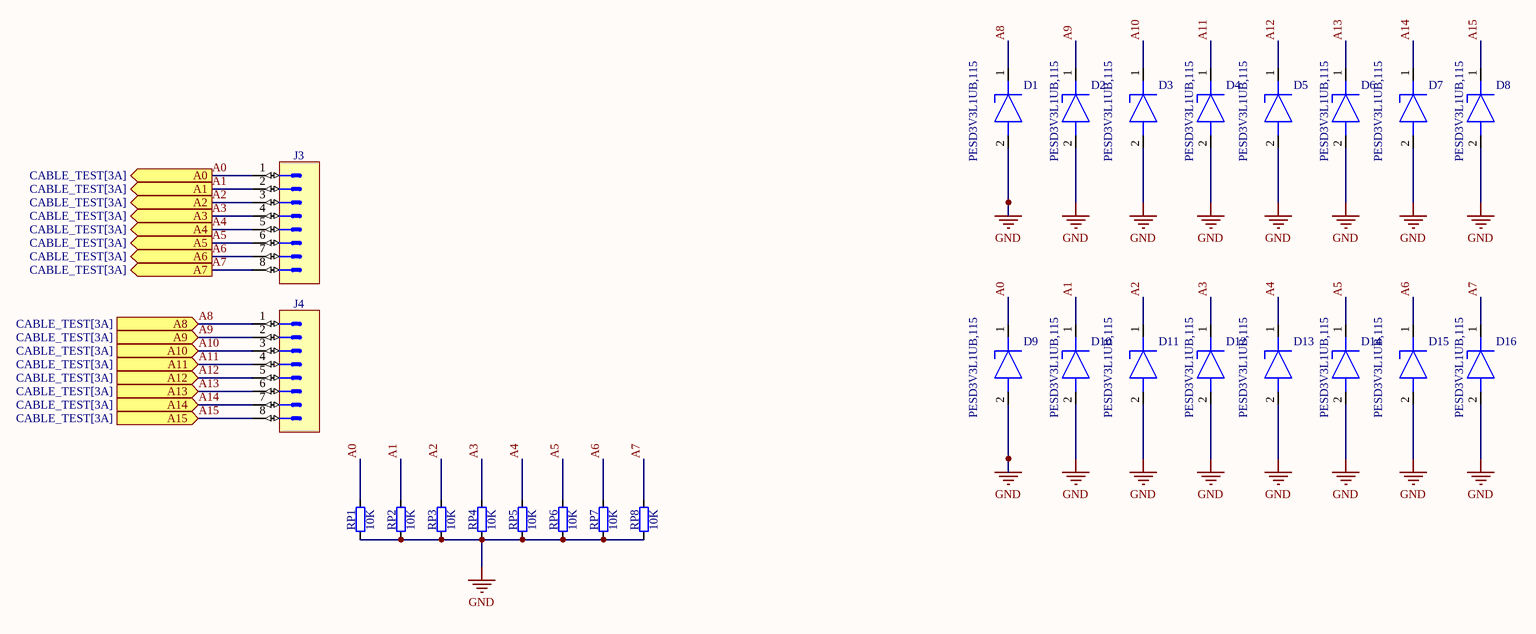
[diagram p6: IO.SchDoc]

### Parts
D1  PESD3V3L1UB,115  [SODFL1608X65N]
D2  PESD3V3L1UB,115  [SODFL1608X65N]
D3  PESD3V3L1UB,115  [SODFL1608X65N]
D4  PESD3V3L1UB,115  [SODFL1608X65N]
D5  PESD3V3L1UB,115  [SODFL1608X65N]
D6  PESD3V3L1UB,115  [SODFL1608X65N]
D7  PESD3V3L1UB,115  [SODFL1608X65N]
D8  PESD3V3L1UB,115  [SODFL1608X65N]
D9  PESD3V3L1UB,115  [SODFL1608X65N]
D10  PESD3V3L1UB,115  [SODFL1608X65N]
D11  PESD3V3L1UB,115  [SODFL1608X65N]
D12  PESD3V3L1UB,115  [SODFL1608X65N]
D13  PESD3V3L1UB,115  [SODFL1608X65N]
D14  PESD3V3L1UB,115  [SODFL1608X65N]
D15  PESD3V3L1UB,115  [SODFL1608X65N]
D16  PESD3V3L1UB,115  [SODFL1608X65N]
J3  (no value)  [PHOENIX_1757307]
J4  (no value)  [PHOENIX_1757307]
RP1  10K  [RESC2012X60N]
RP2  10K  [RESC2012X60N]
RP3  10K  [RESC2012X60N]
RP4  10K  [RESC2012X60N]
RP5  10K  [RESC2012X60N]
RP6  10K  [RESC2012X60N]
RP7  10K  [RESC2012X60N]
RP8  10K  [RESC2012X60N]

### Ports
A0 (out, see CABLE_TEST[3A]), A1 (out, see CABLE_TEST[3A]), A2 (out, see CABLE_TEST[3A]), A3 (out, see CABLE_TEST[3A]), A4 (out, see CABLE_TEST[3A]), A5 (out, see CABLE_TEST[3A]), A6 (out, see CABLE_TEST[3A]), A7 (out, see CABLE_TEST[3A]), A8 (in, see CABLE_TEST[3A]), A9 (in, see CABLE_TEST[3A]), A10 (in, see CABLE_TEST[3A]), A11 (in, see CABLE_TEST[3A]), A12 (in, see CABLE_TEST[3A]), A13 (in, see CABLE_TEST[3A]), A14 (in, see CABLE_TEST[3A]), A15 (in, see CABLE_TEST[3A])

### Nets
GND: D1.2(A) D2.2(A) D3.2(A) D4.2(A) D5.2(A) D6.2(A) D7.2(A) D8.2(A) D9.2(A) D10.2(A) D11.2(A) D12.2(A) D13.2(A) D14.2(A) D15.2(A) D16.2(A) RP1.1 RP2.1 RP3.1 RP4.1 RP5.1 RP6.1 RP7.1 RP8.1
A0: D9.1(K) J3.1 RP1.2 ; port A0
A1: D10.1(K) J3.2 RP2.2 ; port A1
A2: D11.1(K) J3.3 RP3.2 ; port A2
A3: D12.1(K) J3.4 RP4.2 ; port A3
A4: D13.1(K) J3.5 RP5.2 ; port A4
A5: D14.1(K) J3.6 RP6.2 ; port A5
A6: D15.1(K) J3.7 RP7.2 ; port A6
A7: D16.1(K) J3.8 RP8.2 ; port A7
A8: D1.1(K) J4.1 ; port A8
A9: D2.1(K) J4.2 ; port A9
A10: D3.1(K) J4.3 ; port A10
A11: D4.1(K) J4.4 ; port A11
A12: D5.1(K) J4.5 ; port A12
A13: D6.1(K) J4.6 ; port A13
A14: D7.1(K) J4.7 ; port A14
A15: D8.1(K) J4.8 ; port A15

### Library data of the parts
D1-D16 = PESD3V3L1UB,115: Diode ESD (Uni-directional); Manufacturer_Name: Nexperia; Datasheet Link: https://assets.nexperia.com/documents/data-sheet/PESD3V3L1UB.pdf; Height: 0.65mm; Manufacturer_Part_Number: PESD3V3L1UB,115; Mouser Part Number: 771-PESD3V3L1UB115; Mouser Price/Stock: https://www.mouser.co.uk/ProductDetail/Nexperia/PESD3V3L1UB115?qs=LMSg3oBIm%2Fjt%252BUjwy43%2Fgg%3D%3D; Arrow Part Number: PESD3V3L1UB,115; Arrow Price/Stock: https://www.arrow.com/en/products/pesd3v3l1ub115/nexperia?region=nac
J3 J4 = PHOENIX_1757307: Connector 8 Male; Part Description: 12A, 250V, Pitch 5.08mm, 8 Positions Header; Manufacturer: PHOENIX CONTACT; Manufacturer Part Number: 1757307 (MSTBA 2,5/ 8-G-5,08); PressFit: No; Part Number: PHOENIX_1757307; Component Kind: Standard; Component Type: Standard; Pin Count: 8; Mounted: Yes; Socket: No; SMD: No; Sense: No; Status: None; ComponentHeight: 8.6mm; HelpURL: \\cern.ch\dfs\Applications\Altium\Datasheets\PHOENIX_1757307.pdf; Author: CERN DEM JLC; CreateDate: 2/10/2010; LatestRevisionDate: 4/26/2010
RP1-RP8 = R0805_24K_1%_0.125W_100PPM: as R1 on sheet CABLE_TEST; Part Number: R0805_24K_1%_0.125W_100PPM; Component Kind: Standard; Component Type: Standard; Pin Count: 2; Value: 10K; Status: Preferred; Tolerance: ±1%; Manufacturer Part Number: R0805_24K_1%_0.125W_100PPM; Case: 0805; Mounted: Yes; Sense: No; Socket: No; SMD: Yes; HelpURL: \\cern.ch\dfs\Applications\Altium\Datasheets\R0805_NIC_NRC.pdf; Author: CERN DEM JLC; CreateDate: 12/3/2007; LatestRevisionDate: 3/13/2008; Manufacturer1 Example: NIC COMPONENT; Manufacturer1 ComponentHeight: 0.6mm

## Sheet Power.SchDoc
size A; SheetNumber: 8; SheetTotal: 8
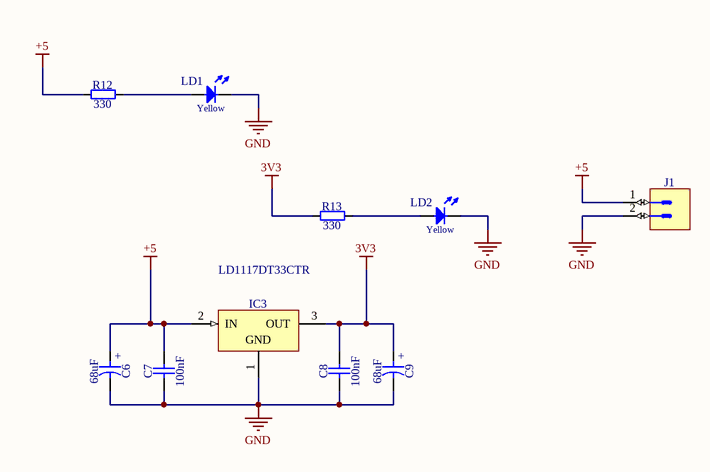
[diagram p7: Power.SchDoc]

### Parts
C6  68uF  [CAPAE660X540N]
C7  100nF  [CAPC2012X135N]
C8  100nF  [CAPC2012X135N]
C9  68uF  [CAPAE660X540N]
IC3  LD1117DT33CTR  [TO228P972X240-3N-R540X510]
J1  Header 2  [JST_B2B-XH-A(LF)(SN)]  (value not drawn)
LD1  Yellow  [LED_3MM_YELLOW_1C-2A]
LD2  Yellow  [LED_3MM_YELLOW_1C-2A]
R12  330  [RESC2012X60N]
R13  330  [RESC2012X60N]

### Nets
3V3: C8.2 C9.1 IC3.3(OUT) R13.1
+5: C6.1 C7.2 IC3.2(IN) J1.1 R12.1
GND: C6.2 C7.1 C8.1 C9.2 IC3.1(GND) J1.2 LD1.1(C) LD2.1(C)
NetLD1_2: LD1.2(A) R12.2
NetLD2_2: LD2.2(A) R13.2

### Notes on the sheet
- (in symbol CAE660-540_220UF_6.3V_20%) +

### Library data of the parts
C6 C9 = CAE660-540_220UF_6.3V_20%: Polarised capacitor; Part Description: Aluminum Electrolytic SMT Capacitor; Manufacturer: PANASONIC; Manufacturer Part Number: EEEFK0J221AP; Voltage: 6.3V; Tolerance: ±20%; Part Number: CAE660-540_220UF_6.3V_20%; Component Kind: Standard; Component Type: Standard; Pin Count: 2; Value: 68uF; Status: Not Recommended; Case: D; Mounted: Yes; Socket: No; SMD: Yes; Sense: No; ComponentHeight: 5.8mm; HelpURL: \\cern.ch\dfs\Applications\Altium\Datasheets\CAE_PANASONIC_FK-V.pdf; Author: CERN DEM JLC; CreateDate: 12/3/2007; LatestRevisionDate: 11/5/2014
C7 C8 = CC0805_100NF_50V_10%_X7R: as C1 on sheet CABLE_TEST; Part Number: CC0805_100NF_50V_10%_X7R; Component Kind: Standard; Component Type: Standard; Pin Count: 2; Value: 100nF; Status: None; Manufacturer Part Number: CC0805_100NF_50V_10%_X7R; Case: 0805; Mounted: Yes; Socket: No; SMD: Yes; Sense: No; Manufacturer1 Example: TDK; Manufacturer1 ComponentHeight: 1mm; HelpURL: \\cern.ch\dfs\Applications\Altium\Datasheets\CC0805_X7R_TDK_C.pdf; Author: CERN DEM JLC; CreateDate: 12/3/2007; LatestRevisionDate: 4/22/2015
IC3 = LD1117DT33CTR: 3-Terminal Regulator 1=GND 2=IN 3=OUT; Part Description: 3.3V 800mA Low drop fixed and adjustable positive voltage regulators; Manufacturer: ST MICROELECTRONICS; PressFit: No; Bonding: No; Part Number: LD1117DT33CTR; Component Kind: Standard; Component Type: Standard; Device: LD1117DT33CTR; PackageDescription: TO-252 DPAK TO, 2.28mm Pitch; 2 Pin, 9.725mm L X 6.10mm W X 2.40mm H body, IPC Medium Density; Manufacturer Part Number: LD1117DT33CTR; Pin Count: 3; Case: DPAK; Mounted: Yes; Socket: No; SMD: Yes; Sense: No; ComponentHeight: 2.4mm; HelpURL: \\cern.ch\dfs\Applications\Altium\Datasheets\LD1117DT33CTR.pdf; Author: CERN DEM JLC; CreateDate: 6/8/2011; LatestRevisionDate: 6/8/2011
J1 = JST_B2B-XH-A(LF)(SN): Connector 2 Male; Part Description: 2 Contacts, 2.5mm Pitch, Top Entry Type Shrouded Header; Manufacturer: JST (JAPAN SOLDERLESS TERMINALS); PressFit: No; Part Number: JST_B2B-XH-A(LF)(SN); Component Kind: Standard; Component Type: Standard; Pin Count: 2; Family: Header 2; Mounted: Yes; Socket: No; SMD: No; Sense: No; Status: None; Manufacturer Part Number: B2B-XH-A(LF)(SN); ComponentHeight: 7mm; HelpURL: \\cern.ch\dfs\Applications\Altium\Datasheets\JST_B2B-XH-A(LF)(SN).pdf; Author: CERN DEM JLC; CreateDate: 8/14/2014; LatestRevisionDate: 8/14/2014
LD1 LD2 = LED_AVAGO_HLMP-1719: as RX1 on sheet TTL_USB; Part Number: LED_AVAGO_HLMP-1719; Component Kind: Standard; Component Type: Standard; Color: Yellow; PackageDescription: LED, Yellow, Body Dia. 3.43 mm, Pin spacing 2.54mm; Manufacturer Part Number: HLMP-1719; Pin Count: 2; Mounted: Yes; Socket: No; SMD: No; Sense: No; ComponentHeight: 6.35mm(min); HelpURL: \\cern.ch\dfs\Applications\Altium\Datasheets\LED_AVAGO_HLMP-1719.pdf; Author: CERN DEM JLC; CreateDate: 6/12/2008; LatestRevisionDate: 3/17/2010
R12 R13 = R0805_24K_1%_0.125W_100PPM: as R1 on sheet CABLE_TEST; Part Number: R0805_24K_1%_0.125W_100PPM; Component Kind: Standard; Component Type: Standard; Pin Count: 2; Value: 330; Status: Preferred; Tolerance: ±1%; Manufacturer Part Number: R0805_24K_1%_0.125W_100PPM; Case: 0805; Mounted: Yes; Sense: No; Socket: No; SMD: Yes; HelpURL: \\cern.ch\dfs\Applications\Altium\Datasheets\R0805_NIC_NRC.pdf; Author: CERN DEM JLC; CreateDate: 12/3/2007; LatestRevisionDate: 3/13/2008; Manufacturer1 Example: NIC COMPONENT; Manufacturer1 ComponentHeight: 0.6mm

## Nets that join several sheets
3V3: CABLE_TEST (BOOT1.1), down (R3_down.2), S1 (S1_S1.5), up (R3_up.2), left (R3_left.2), right (R3_right.2), enter (R3_enter.2), spare (R3_spare.2), rst (R3_rst.2), S2 (S1_S2.5), S3 (S1_S3.5), S4 (S1_S4.5), LCD (DS1.2 R5.2 R6.2), TTL_USB (9 pins), MCU (17 pins), Power (C8.2 C9.1 IC3.3 R13.1)
+5: TTL_USB (R9.2 USB1.A4_B9 USB1.B4_A9), Power (5 pins)
GND: CABLE_TEST (C1.1 R1.2), down (B1_down.1 C2_down.1), S1 (S1_S1.2), up (B1_up.1 C2_up.1), left (B1_left.1 C2_left.1), right (B1_right.1 C2_right.1), enter (B1_enter.1 C2_enter.1), spare (B1_spare.1 C2_spare.1), rst (B1_rst.1 C2_rst.1), S2 (S1_S2.2), S3 (S1_S3.2), S4 (S1_S4.2), LCD (DS1.1), TTL_USB (15 pins), MCU (20 pins), IO (24 pins), Power (8 pins)
A0: MCU (MCU1.26), IO (D9.1 J3.1 RP1.2)
A1: MCU (MCU1.27), IO (D10.1 J3.2 RP2.2)
A2: MCU (MCU1.28), IO (D11.1 J3.3 RP3.2)
A3: MCU (MCU1.55), IO (D12.1 J3.4 RP4.2)
A4: MCU (MCU1.56), IO (D13.1 J3.5 RP5.2)
A5: MCU (MCU1.57), IO (D14.1 J3.6 RP6.2)
A6: MCU (MCU1.58), IO (D15.1 J3.7 RP7.2)
A7: MCU (MCU1.59), IO (D16.1 J3.8 RP8.2)
A8: MCU (MCU1.61), IO (D1.1 J4.1)
A9: MCU (MCU1.62), IO (D2.1 J4.2)
A10: MCU (MCU1.29), IO (D3.1 J4.3)
A11: MCU (MCU1.30), IO (D4.1 J4.4)
A12: MCU (MCU1.33), IO (D5.1 J4.5)
A13: MCU (MCU1.34), IO (D6.1 J4.6)
A14: MCU (MCU1.35), IO (D7.1 J4.7)
A15: MCU (MCU1.36), IO (D8.1 J4.8)
BOOT: S4 (S1_S4.6), MCU (MCU1.60)
BOOTB: CABLE_TEST (C1.2 R1.1 R2.2), S4 (S1_S4.1)
DOWN: S2 (S1_S2.6), MCU (MCU1.51)
ENTER: S1 (S1_S1.6), MCU (MCU1.39)
LEFT: S3 (S1_S3.6), MCU (MCU1.53)
NetC2_down_2: down (C2_down.2 R3_down.1 R4_down.2), S2 (S1_S2.1)
NetC2_enter_2: S1 (S1_S1.1), enter (C2_enter.2 R3_enter.1 R4_enter.2)
NetC2_left_2: left (C2_left.2 R3_left.1 R4_left.2), S3 (S1_S3.1)
NetC2_right_2: right (C2_right.2 R3_right.1 R4_right.2), S2 (S1_S2.3)
NetC2_rst_2: rst (C2_rst.2 R3_rst.1 R4_rst.2), S4 (S1_S4.3)
NetC2_spare_2: spare (C2_spare.2 R3_spare.1 R4_spare.2), S3 (S1_S3.3)
NetC2_up_2: S1 (S1_S1.3), up (C2_up.2 R3_up.1 R4_up.2)
NRST: S4 (S1_S4.4), MCU (J2.2 MCU1.7)
PA8: LCD (DS1.3 R6.1), MCU (MCU1.41)
PA9: TTL_USB (IC2.20), MCU (MCU1.42)
PA10: TTL_USB (IC2.21), MCU (MCU1.43)
PC9: LCD (DS1.4 R5.1), MCU (MCU1.40)
RIGHT: S2 (S1_S2.4), MCU (MCU1.52)
SPARE: S3 (S1_S3.4), MCU (MCU1.54)
UP: S1 (S1_S1.4), MCU (MCU1.50)